# EasyEDA schematic SCH_ECD project_1_2023-12-09.json
TITLE: Sheet_1; REV: 1.0; Date: 2023-12-09; Sheet: 1/1; Drawn By: d.kidhu; Company: Your Company
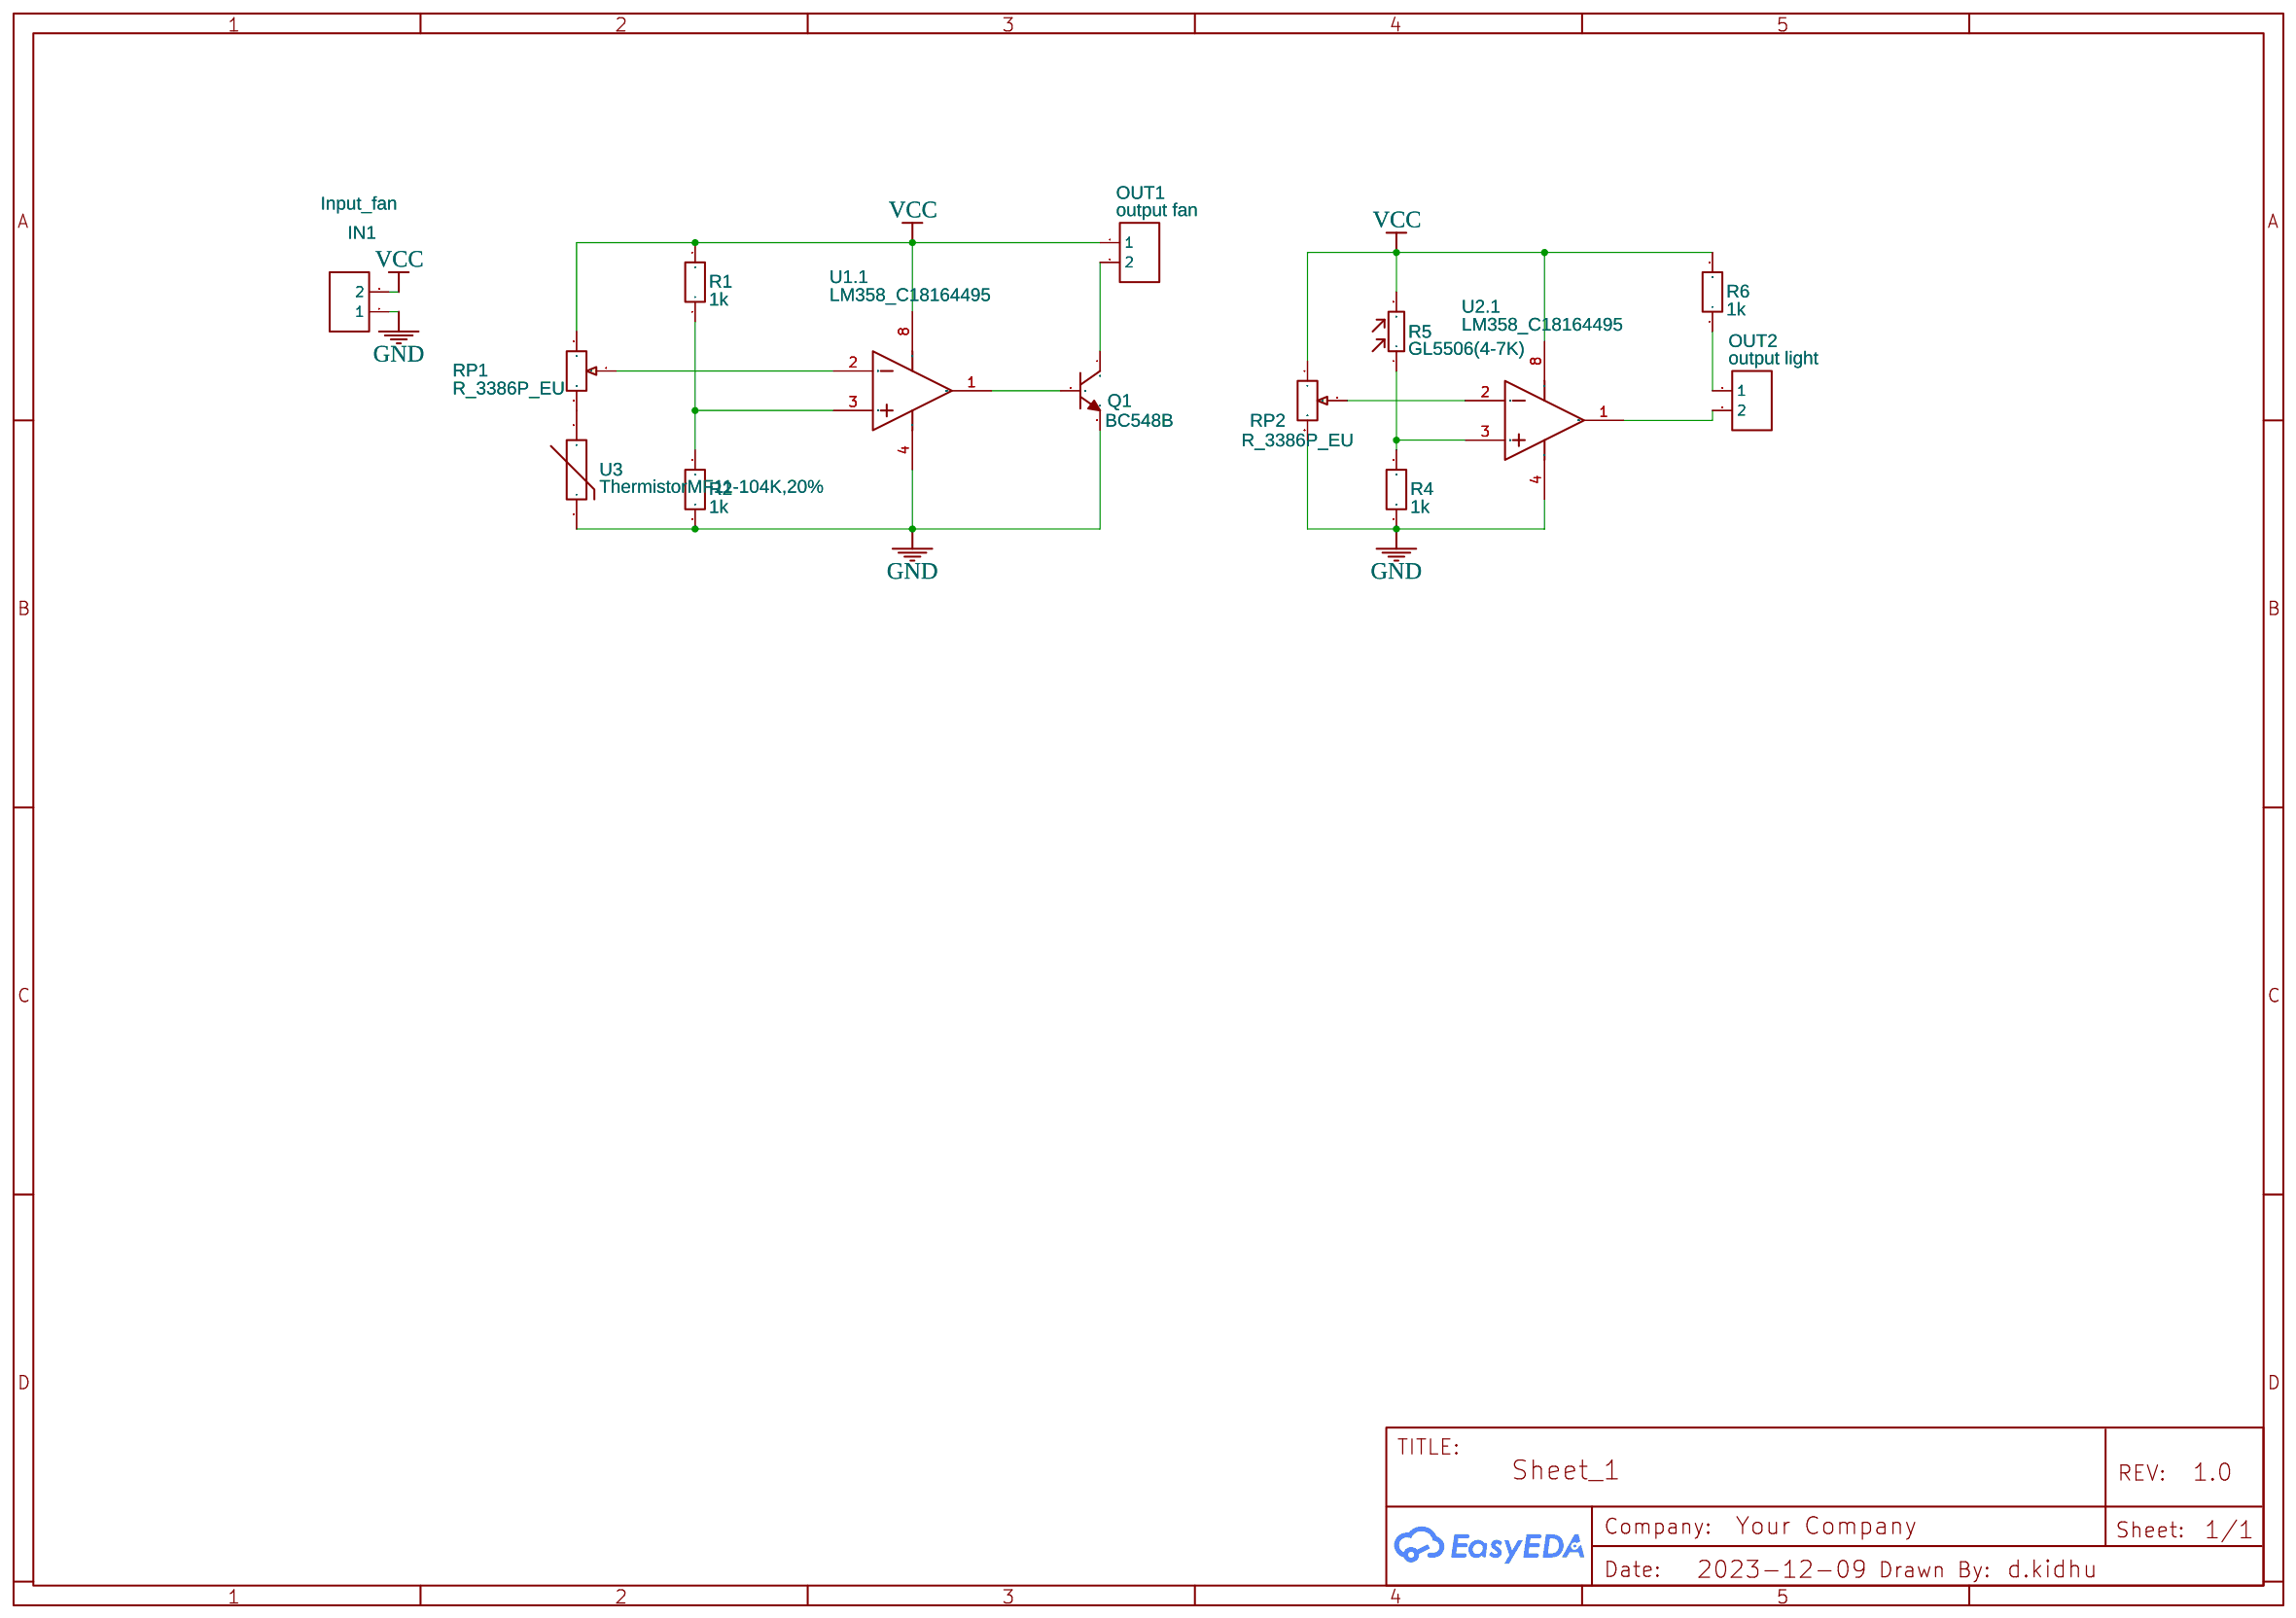
[diagram p0: schematic sheet]

## Parts
IN1  Input_fan  [HDR-F-2.54_1X2]
OUT1  output fan  [HDR-F-2.54_1X2]
OUT2  output light  [HDR-F-2.54_1X2]
Q1  BC548B  [TO-92-3_L4.9-W3.7-P1.27-L]
R1  1k  [R0603]
R2  1k  [R0603]
R4  1k  [R0603]
R5  GL5506(4-7K)  [RES-TH_L5.1-W4.3-P3.00-D0.5]
R6  1k  [R0603]
RP1  R_3386P_EU  [RES-ADJ-TH_3386P]
RP2  R_3386P_EU  [RES-ADJ-TH_3386P]
U1  LM358_C18164495  [SOIC-8_L4.9-W3.9-P1.27-LS6.0-BL]  (section 1)
U2  LM358_C18164495  [SOIC-8_L4.9-W3.9-P1.27-LS6.0-BL]  (section 1)
U3  ThermistorMF11-104K,20%  [RES-TH_L6.5-W4.0-P2.50-D0.5]

## Library data of the parts
IN1 OUT1 OUT2 = HDR-F-2.54_1x2: Supplier Part: C49661; Supplier: LCSC; Contributor: LCEDA_Lib
Q1 = BC548B: Supplier: LCSC; Manufacturer: CJ(江苏长电/长晶); Manufacturer Part: BC548; Supplier Part: C36611; JLCPCB Part Class: Extended Part; link: https://lcsc.com/eda_search?q=C36611&%26type=1&ref=editor
R1 R2 R4 R6 = R_0603_EU: Contributor: LCEDA_Lib
R5 = GL5506(4-7K): Supplier: LCSC; Manufacturer: JCHL(晶创和立); Manufacturer Part: GL5506（4-7K）; Supplier Part: C11299; JLCPCB Part Class: Extended Part; link: https://lcsc.com/eda_search?q=C11299&%26type=1&ref=editor
RP1 RP2 = R_3386P_EU: Supplier: LCSC; Contributor: LCEDA_Lib; Value(Ω): 10K
U1 U2 = LM358_C18164495: Supplier: LCSC; Supplier Part: C18164495; Manufacturer: GR(国睿); Manufacturer Part: LM358; subpart_no: 1; link: https://lcsc.com/eda_search?q=C18164495&%26type=1&ref=editor
U3 = MF11-104K: Supplier: LCSC; Manufacturer: Shiheng; Supplier Part: C40773; Contributor: 官方封装库; link: https://lcsc.com/eda_search?q=C40773&%26type=1&ref=editor; 3DModel: RES-TH_L6.5-W4.0-H10.0-P2.50-D0.5

## Nets
GND: IN1.1 Q1.3(E) R2.2 R4.1 RP2.3 U1.4(VEE) U2.4(VEE) U3.1
VCC: IN1.2 OUT1.1 R1.2 R5.2 R6.2 RP1.1 RP2.1 U1.8(VCC) U2.8(VCC)
Net-(OUT1-2): OUT1.2 Q1.1(C)
Net-(OUT2-1): OUT2.1 R6.1
Net-(OUT2-2): OUT2.2 U2.1(OUT A)
Net-(Q1-2): Q1.2(B) U1.1(OUT A)
Net-(R1-1): R1.1 R2.1 U1.3(IN A+)
Net-(R4-2): R4.2 R5.1 U2.3(IN A+)
Net-(RP1-2): RP1.2 U1.2(IN A-)
Net-(RP1-3): RP1.3 U3.2
Net-(RP2-2): RP2.2 U2.2(IN A-)
